# EAGLE design untitled (EAGLE 9.0.1)
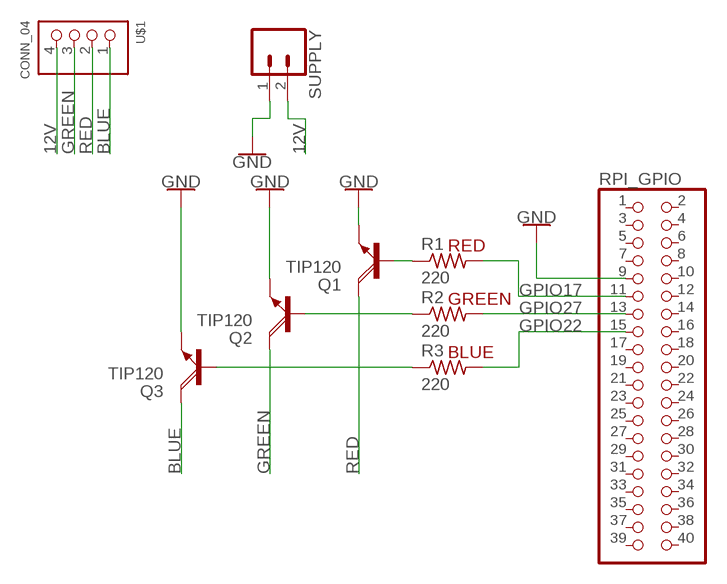
[diagram p0: schematic, sheet 1]

## Parts
Q1  TIP120  [TO220AH]
Q2  TIP120  [TO220AH]
Q3  TIP120  [TO220AH]
R1  220  R-US_0207/10  [0207/10]
R2  220  R-US_0207/10  [0207/10]
R3  220  R-US_0207/10  [0207/10]
RPI_GPIO  PINHD-2X20  [2X20]
SUPPLY  CONN_025MM  [SCREWTERMINAL-5MM-2]
U$1  CONN_04  [SCREWTERMINAL-5MM-4]

## Nets
12V: SUPPLY.2 U$1.4
BLUE: Q3.C U$1.1
GND: Q1.E Q2.E Q3.E RPI_GPIO.9 SUPPLY.1
GPIO17: R1.2 RPI_GPIO.11
GPIO22: R3.2 RPI_GPIO.15
GPIO27: R2.2 RPI_GPIO.13
GREEN: Q2.C U$1.3
N$1: Q1.B R1.1
N$2: Q2.B R2.1
N$3: Q3.B R3.1
RED: Q1.C U$1.2
Unconnected: RPI_GPIO.1 RPI_GPIO.2 RPI_GPIO.3 RPI_GPIO.4 RPI_GPIO.5 RPI_GPIO.6 RPI_GPIO.7 RPI_GPIO.8 RPI_GPIO.10 RPI_GPIO.12 RPI_GPIO.14 RPI_GPIO.16 RPI_GPIO.17 RPI_GPIO.18 RPI_GPIO.19 RPI_GPIO.20 RPI_GPIO.21 RPI_GPIO.22 RPI_GPIO.23 RPI_GPIO.24 RPI_GPIO.25 RPI_GPIO.26 RPI_GPIO.27 RPI_GPIO.28 RPI_GPIO.29 RPI_GPIO.30 RPI_GPIO.31 RPI_GPIO.32 RPI_GPIO.33 RPI_GPIO.34 RPI_GPIO.35 RPI_GPIO.36 RPI_GPIO.37 RPI_GPIO.38 RPI_GPIO.39 RPI_GPIO.40

## Notes on the sheet
- RED
- GREEN
- BLUE

## Library data of the parts
Q1-Q3 = transistor-power:TIP120: NPN DARLINGTON TRANSISTOR
R1-R3 = adafruit:R-US_: RESISTOR, American symbol
RPI_GPIO = adafruit:PINHD-2X20: PIN HEADER
SUPPLY = SparkFun-Connectors:CONN_02: Multi connection point. Often used as Generic Header-pin footprint for 0.1 inch spaced/style header connections On any of the 0.1 inch spaced packages, you can populate with these: Break Away Headers - Straight <https://www.sparkfun.com/products/116> (PRT-00116) Break Away Male Headers - Right Angle <https://www.sparkfun.com/products/553> (PRT-00553) Female Headers <https://www.sparkfun.com/products/115> (PRT-00115) Break Away Headers - Machine Pin <https://www.sparkfun.com/products/117> (PRT-00117) Break Away Female Headers - Swiss Machine Pin <https://www.sparkfun.com/products/743> (PRT-00743) For SCREWTERMINALS and SPRING TERMINALS visit here: Screw Terimnals on SparkFun.com <https://www.sparkfun.com/search/results?term=Screw+Terminals> (5mm/3.5mm/2.54mm spacing) This device is also useful as a general connection point to wire up your design to another part of your project. Our various solder wires solder well into these plated through hole pads. Hook-Up Wire - Assortment (Stranded, 22 AWG) <https://www.sparkfun.com/products/11375> (PRT-11375) Hook-Up Wire - Assortment (Solid Core, 22 AWG) <https://www.sparkfun.com/products/11367> (PRT-11367) View the entire wire category on our website here <https://www.sparkfun.com/categories/141> Special notes: Molex polarized connector foot print use with: PRT-08233 with associated crimp pins and housings. 2.54_SCREWTERM for use with PRT-10571. 3.5mm Screw Terminal footprints for PRT-08084 5mm Screw Terminal footprints for use with PRT-08432; SF_SKU: PRT-08432
U$1 = Pamir:CONN_04

## Board
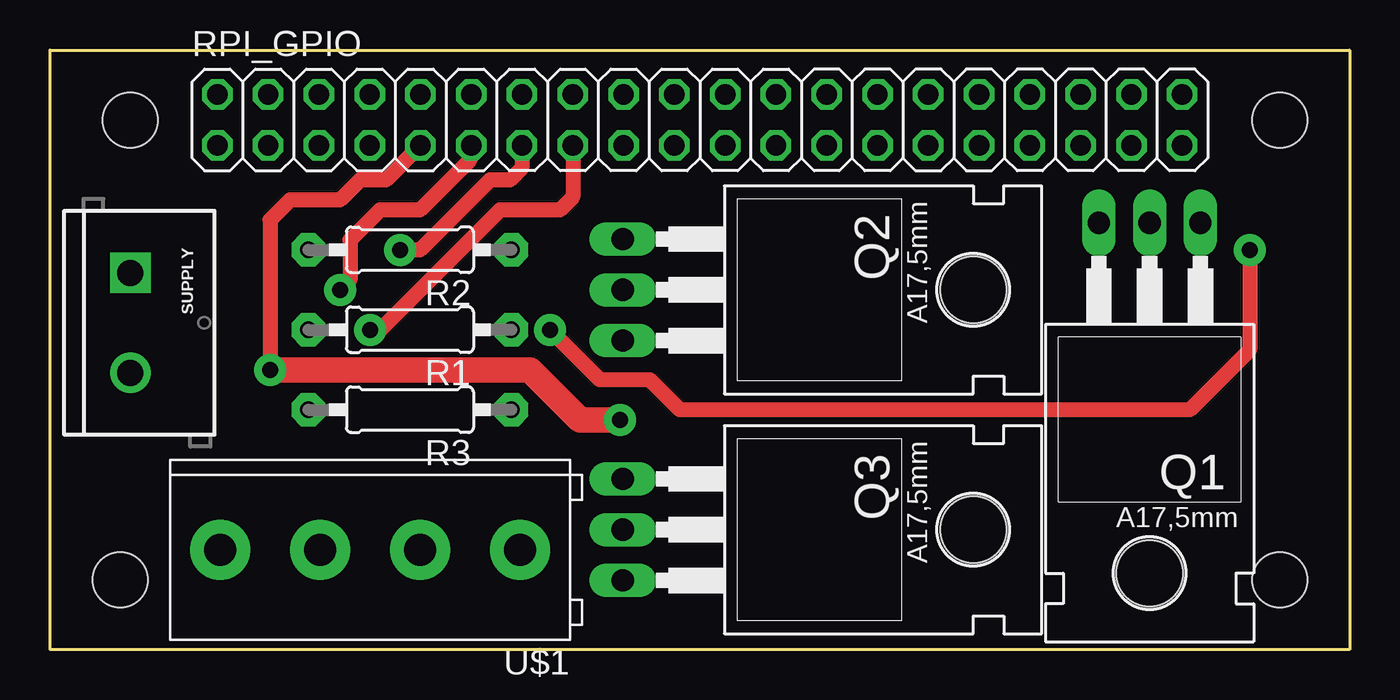
[diagram p1: board, top side]
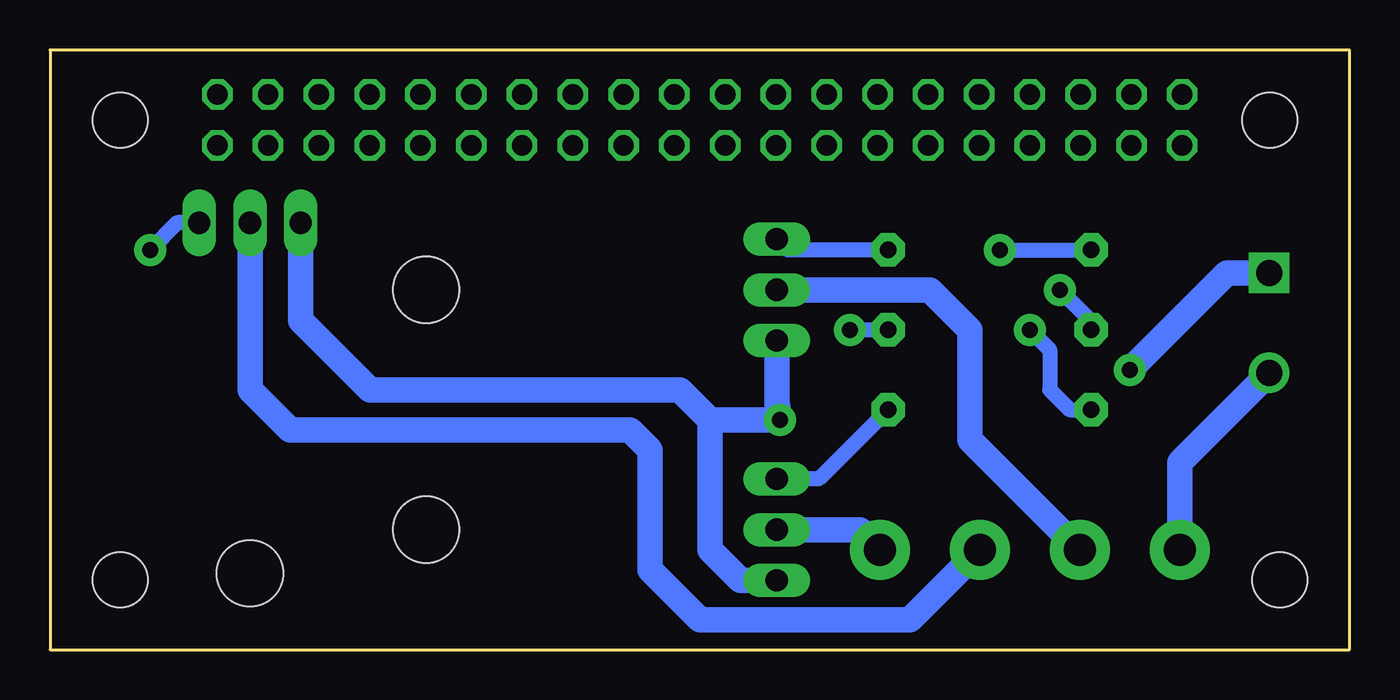
[diagram p2: board, bottom side, seen from below]

Size 65 x 30 mm. Coordinates in mm from the lower left corner, seen from the top.
Outline: 0,0 0,30 65,30 65,0 0,0
Copper layers (1*16): Top 0.035mm / dielectric 1.5mm / Bottom 0.035mm
Design rules "SeeedStudio_2layer_DRU_no_angle_20140221": minimum track width 6mil, minimum drill 12mil, track to track 6mil, track to pad 6mil, pad to pad 6mil, via to via 6mil, smd to smd 0mil, copper to edge 10mil, drill to drill 10mil, minimum pad ring 10mil, minimum via ring 6mil, stop-mask expansion 2mil, vias tented up to drill 100mil, thermal gap 10mil
Holes 2.75 mm at 4,26.5 3.5,3.5 61.5,3.5 61.5,26.5

### Footprints (pad centres in the part's own frame; a part is rotated, then mirrored left to right if it is on the bottom)
TO220AH = drill 1.118 long: B -2.54,-6.35; C 0,-6.35; E 2.54,-6.35 | hole 3.302: 0,11.176
0207/10 = drill 0.813 pad 1.676 octagon: 1 -5.08,0; 2 5.08,0
2X20 = drill 1.016 octagon: 1 -24.13,-1.27; 2 -24.13,1.27; 3 -21.59,-1.27; 4 -21.59,1.27; 5 -19.05,-1.27; 6 -19.05,1.27; 7 -16.51,-1.27; 8 -16.51,1.27; 9 -13.97,-1.27; 10 -13.97,1.27; 11 -11.43,-1.27; 12 -11.43,1.27; 13 -8.89,-1.27; 14 -8.89,1.27; 15 -6.35,-1.27; 16 -6.35,1.27; 17 -3.81,-1.27; 18 -3.81,1.27; 19 -1.27,-1.27; 20 -1.27,1.27; 21 1.27,-1.27; 22 1.27,1.27; 23 3.81,-1.27; 24 3.81,1.27; 25 6.35,-1.27; 26 6.35,1.27; 27 8.89,-1.27; 28 8.89,1.27; 29 11.43,-1.27; 30 11.43,1.27; 31 13.97,-1.27; 32 13.97,1.27; 33 16.51,-1.27; 34 16.51,1.27; 35 19.05,-1.27; 36 19.05,1.27; 37 21.59,-1.27; 38 21.59,1.27; 39 24.13,-1.27; 40 24.13,1.27
SCREWTERMINAL-5MM-2 = drill 1.3 pad 2.032 square: 1 0,0 | drill 1.3 pad 2.032: 2 5,0
SCREWTERMINAL-5MM-4 = drill 1.6 pad 3: 1 -7.5,0; 2 -2.5,0; 3 2.5,0; 4 7.5,0

### Placement (x,y rotation side)
Q1  55,15 180 top
Q2  35,18 270 top
Q3  35,6 270 top
R1  18,16 180 top
R2  18,20 180 top
R3  18,12 180 top
RPI_GPIO  32.5,26.5 0 top
SUPPLY  4.02,18.85 270 top
U$1  16,5 180 top

### Tracks (layer width: path | path; a pad name or v marks a point on that pad's centre or on a via)
12V
  Bottom 1.27: SUPPLY.2 8.5,9.37 U$1.4
BLUE
  Bottom 1.27: U$1.1 24.5,6 Q3.C
GND  (via drill 0.8 pad 1.6)
  Top 0.762: RPI_GPIO.9 16.8,23.5 15.5,23.5 14.5,22.5 12,22.5 11,21.5 v11,14
  Top 1.27: v28.5,11.5 26.5,11.5 24,14 v11,14
  Bottom 1.27: Q3.E 30.46,3.46 32,5 32,11.5 | 32,11.5 v28.5,11.5 28.65,12.35 Q2.E | v11,14 6.15,18.85 SUPPLY.1 | 32,11.5 33.5,13 49,13 52.46,16.46 Q1.E
GPIO17  (via drill 0.8 pad 1.6)
  Top 0.762: RPI_GPIO.11 21,25.16 21,24.5 18.5,22 16.5,22 15,20.5 15,18.5 v14.5,18
  Bottom 0.762: v14.5,18 12.92,16.42 R1.2
GPIO22  (via drill 0.8 pad 1.6)
  Top 0.762: RPI_GPIO.15 26.15,22.65 25.5,22 22.5,22 16.5,16 v16,16
  Bottom 0.762: v16,16 15,15 15,13 14,12 R3.2
GPIO27  (via drill 0.8 pad 1.6)
  Top 0.762: RPI_GPIO.13 23.61,24.11 23,23.5 22,23.5 18.5,20 v17.5,20
  Bottom 0.762: v17.5,20 R2.2
GREEN
  Bottom 1.27: U$1.3 19,10.5 19,16 21,18 Q2.C
N$1  (via drill 0.8 pad 1.6)
  Top 0.762: v60,20 60,15 57,12 31.5,12 30,13.5 27.5,13.5 v25,16
  Bottom 0.762: Q1.B 58.65,21.35 v60,20 | R1.1 v25,16
N$2
  Bottom 0.762: R2.1 28.11,20 Q2.B
N$3
  Bottom 0.762: R3.1 26.54,8.54 Q3.B
RED
  Bottom 1.27: Q1.C 55,13 53,11 36,11 35,10 35,4 32.5,1.5 22,1.5 U$1.2